# EAGLE schematic Skaarhoj BI8-2x4v1.1 (EAGLE 6.2)
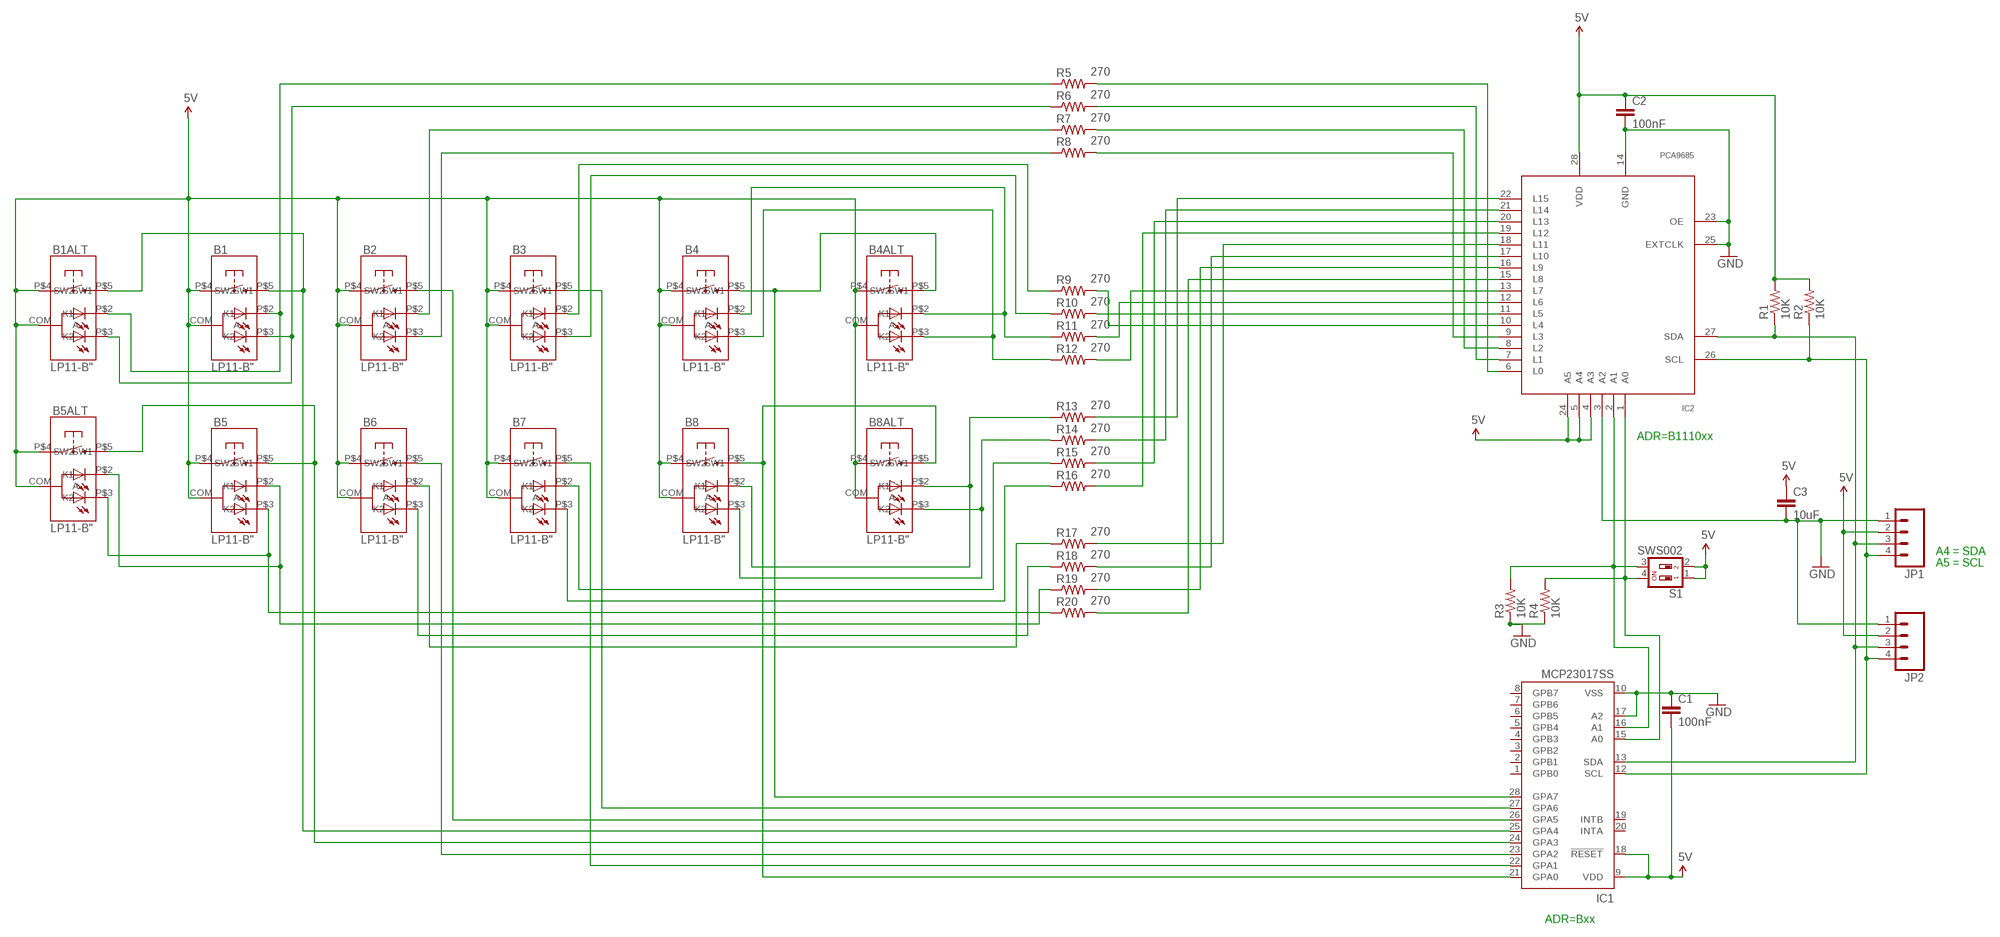
[diagram p0: schematic, sheet 1]

## Parts
B1  LP11-B"  [LP11]
B1ALT  LP11-B"  [LP11]
B2  LP11-B"  [LP11]
B3  LP11-B"  [LP11]
B4  LP11-B"  [LP11]
B4ALT  LP11-B"  [LP11]
B5  LP11-B"  [LP11]
B5ALT  LP11-B"  [LP11]
B6  LP11-B"  [LP11]
B7  LP11-B"  [LP11]
B8  LP11-B"  [LP11]
B8ALT  LP11-B"  [LP11]
C1  100nF  CAP0603-CAP  [0603-CAP]
C2  100nF  CAP0603-CAP  [0603-CAP]
C3  10uF  CAP0805  [0805]
IC1  MCP23017SS  [SSOP28]
IC2  PCA9685  [TSSOP28]
JP1  M04PTH  [1X04]
JP2  M04PTH  [1X04]
R1  10K  RESISTOR0603-RES  [0603-RES]
R2  10K  RESISTOR0603-RES  [0603-RES]
R3  10K  RESISTOR0603-RES  [0603-RES]
R4  10K  RESISTOR0603-RES  [0603-RES]
R5  270  RESISTOR0603-RES  [0603-RES]
R6  270  RESISTOR0603-RES  [0603-RES]
R7  270  RESISTOR0603-RES  [0603-RES]
R8  270  RESISTOR0603-RES  [0603-RES]
R9  270  RESISTOR0603-RES  [0603-RES]
R10  270  RESISTOR0603-RES  [0603-RES]
R11  270  RESISTOR0603-RES  [0603-RES]
R12  270  RESISTOR0603-RES  [0603-RES]
R13  270  RESISTOR0603-RES  [0603-RES]
R14  270  RESISTOR0603-RES  [0603-RES]
R15  270  RESISTOR0603-RES  [0603-RES]
R16  270  RESISTOR0603-RES  [0603-RES]
R17  270  RESISTOR0603-RES  [0603-RES]
R18  270  RESISTOR0603-RES  [0603-RES]
R19  270  RESISTOR0603-RES  [0603-RES]
R20  270  RESISTOR0603-RES  [0603-RES]
S1  SWS002  [SMS-002]

## Nets
5V [Power]: B1.COM(A) B1.P$4(SW1) B1ALT.COM(A) B1ALT.P$4(SW1) B2.COM(A) B2.P$4(SW1) B3.COM(A) B3.P$4(SW1) B4.COM(A) B4.P$4(SW1) B4ALT.COM(A) B4ALT.P$4(SW1) B5.COM(A) B5.P$4(SW1) B5ALT.COM(A) B5ALT.P$4(SW1) B6.COM(A) B6.P$4(SW1) B7.COM(A) B7.P$4(SW1) B8.COM(A) B8.P$4(SW1) B8ALT.COM(A) B8ALT.P$4(SW1) C1.2 C2.1 C3.1 IC1.9(VDD) IC1.18(!RESET) IC2.4(A3) IC2.5(A4) IC2.24(A5) IC2.28(VDD) JP1.2 JP2.2 R1.2 R2.2 S1.1 S1.2
GND [Power]: C1.1 C2.2 C3.2 IC1.10(VSS) IC1.17(A2) IC2.3(A2) IC2.14(GND) IC2.23(OE) IC2.25(EXTCLK) JP1.1 JP2.1 R3.1 R4.1
N$1: IC1.15(A0) IC2.1(A0) R4.2 S1.4
N$3: IC1.13(SDA) IC2.27(SDA) JP1.3 JP2.3 R1.1
N$4: B2.P$2(K1) R7.1
N$5: B2.P$3(K2) R8.1
N$6: IC1.12(SCL) IC2.26(SCL) JP1.4 JP2.4 R2.1
N$7: B1.P$2(K1) B1ALT.P$2(K1) R5.1
N$8: B1.P$3(K2) B1ALT.P$3(K2) R6.1
N$9: IC2.6(L0) R5.2
N$10: IC2.7(L1) R6.2
N$11: IC2.8(L2) R7.2
N$12: IC2.9(L3) R8.2
N$13: IC2.10(L4) R9.2
N$14: IC2.11(L5) R10.2
N$15: IC2.12(L6) R11.2
N$16: IC2.13(L7) R12.2
N$17: B3.P$2(K1) R9.1
N$18: B3.P$3(K2) R10.1
N$19: B4.P$2(K1) B4ALT.P$2(K1) R11.1
N$20: B4.P$3(K2) B4ALT.P$3(K2) R12.1
N$21: IC2.19(L12) R16.2
N$22: IC2.20(L13) R15.2
N$23: IC2.21(L14) R14.2
N$24: IC2.22(L15) R13.2
N$25: IC2.15(L8) R20.2
N$26: IC2.16(L9) R19.2
N$27: IC2.17(L10) R18.2
N$28: IC2.18(L11) R17.2
N$29: B5.P$3(K2) B5ALT.P$3(K2) R20.1
N$30: B5.P$2(K1) B5ALT.P$2(K1) R19.1
N$31: B6.P$3(K2) R18.1
N$32: B6.P$2(K1) R17.1
N$33: B7.P$3(K2) R16.1
N$34: B7.P$2(K1) R15.1
N$35: B8.P$3(K2) B8ALT.P$3(K2) R14.1
N$36: B8.P$2(K1) B8ALT.P$2(K1) R13.1
N$37: B1.P$5(SW2) B1ALT.P$5(SW2) IC1.25(GPA4)
N$38: B5.P$5(SW2) B5ALT.P$5(SW2) IC1.24(GPA3)
N$39: B6.P$5(SW2) IC1.23(GPA2)
N$40: B2.P$5(SW2) IC1.26(GPA5)
N$41: B8.P$5(SW2) B8ALT.P$5(SW2) IC1.21(GPA0)
N$42: B7.P$5(SW2) IC1.22(GPA1)
N$43: B4.P$5(SW2) B4ALT.P$5(SW2) IC1.28(GPA7)
N$44: B3.P$5(SW2) IC1.27(GPA6)
N$47: IC1.16(A1) IC2.2(A1) R3.2 S1.3
Unconnected: IC1.1(GPB0) IC1.2(GPB1) IC1.3(GPB2) IC1.4(GPB3) IC1.5(GPB4) IC1.6(GPB5) IC1.7(GPB6) IC1.8(GPB7) IC1.19(INTB) IC1.20(INTA)

## Notes on the sheet
- ADR=B1110xx
- A4 = SDA
- A5 = SCL
- ADR=Bxx

## Library data of the parts
B1 B1ALT B2-B4 B4ALT B5 B5ALT B6-B8 B8ALT = SKAARHOJ:LP11-B
C1-C3 = SparkFun:CAP: Capacitor Standard 0603 ceramic capacitor, and 0.1" leaded capacitor.
IC1 = microchip:MCP23017: http://ww1.microchip.com/downloads/en/DeviceDoc/21952a.pdf Source: http://ww1.microchip.com/downloads/en/DeviceDoc/21952a.pdf; MF: MICROCHIP; MPN: MCP23017-E/SS; OC_FARNELL: 1467674; OC_NEWARK: 31K2960
IC2 = wsmith:PCA9685
JP1 JP2 = SparkFun:M04: Header 4 Standard 4-pin 0.1" header. Use with straight break away headers (SKU : PRT-00116), right angle break away headers (PRT-00553), swiss pins (PRT-00743), machine pins (PRT-00117), and female headers (PRT-00115). Molex polarized connector foot print use with SKU : PRT-08231 with associated crimp pins and housings. 1MM SMD Version SKU: PRT-10208
R1-R20 = SparkFun:RESISTOR: Resistor Basic schematic elements and footprints for 0603, 1206, and PTH resistors.
S1 = smd-special:SWS002: SMD Dip Switch 2 pol.